# EAGLE design NTcounterRX (EAGLE 9.0.1)
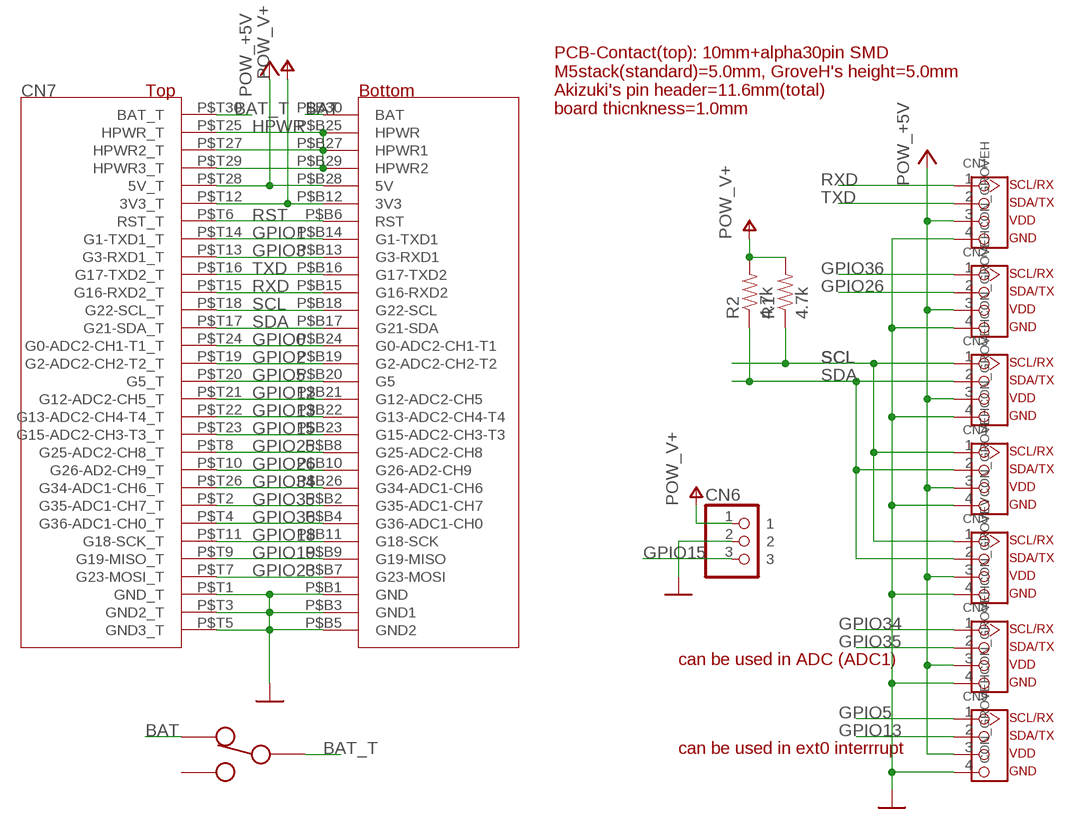
[diagram p0: schematic, sheet 1]

## Parts
CN1  CON_GROVEH  [CON_GROVE_H]
CN2  CON_GROVEH  [CON_GROVE_H]
CN3  CON_GROVEH  [CON_GROVE_H]
CN4  CON_GROVEH  [CON_GROVE_H]
CN5  CON_GROVEV  [CON_GROVE_V]
CN6  CON_PINHD-1X3R  [1X03R]
CN7  MBUS_SEPBAT  [MBUS_SEP_BAT_SHORT]
CN8  CON_GROVEH  [CON_GROVE_H]
CN9  CON_GROVEH  [CON_GROVE_H]
R1  4.7k  RES0603  [0603]
R2  4.7k  RES0603  [0603]
SW1  SW_SLIDESK12D01  [SW_SK12D01]

## Nets
+5V: CN1.3 CN2.3 CN3.3 CN4.3 CN5.3 CN7.P$B28(5V) CN7.P$T28(5V_T) CN8.3 CN9.3 ; supply symbol labelled POW_+5V
BAT: CN7.P$B30(BAT) SW1.P$1
BAT_T: CN7.P$T30(BAT_T) SW1.P$2
GND: CN1.4 CN2.4 CN3.4 CN4.4 CN5.4 CN6.2 CN7.P$B1(GND) CN7.P$B3(GND1) CN7.P$B5(GND2) CN7.P$T1(GND_T) CN7.P$T3(GND2_T) CN7.P$T5(GND3_T) CN8.4 CN9.4 ; supply symbol labelled POW_GND
GPIO0: CN7.P$B24(G0-ADC2-CH1-T1) CN7.P$T24(G0-ADC2-CH1-T1_T)
GPIO1: CN7.P$B14(G1-TXD1) CN7.P$T14(G1-TXD1_T)
GPIO2: CN7.P$B19(G2-ADC2-CH2-T2) CN7.P$T19(G2-ADC2-CH2-T2_T)
GPIO3: CN7.P$B13(G3-RXD1) CN7.P$T13(G3-RXD1_T)
GPIO5: CN7.P$B20(G5) CN7.P$T20(G5_T) CN9.1
GPIO12: CN7.P$B21(G12-ADC2-CH5) CN7.P$T21(G12-ADC2-CH5_T)
GPIO13: CN7.P$B22(G13-ADC2-CH4-T4) CN7.P$T22(G13-ADC2-CH4-T4_T) CN9.2
GPIO15: CN6.3 CN7.P$B23(G15-ADC2-CH3-T3) CN7.P$T23(G15-ADC2-CH3-T3_T)
GPIO18: CN7.P$B11(G18-SCK) CN7.P$T11(G18-SCK_T)
GPIO19: CN7.P$B9(G19-MISO) CN7.P$T9(G19-MISO_T)
GPIO23: CN7.P$B7(G23-MOSI) CN7.P$T7(G23-MOSI_T)
GPIO25: CN7.P$B8(G25-ADC2-CH8) CN7.P$T8(G25-ADC2-CH8_T)
GPIO26: CN2.2 CN7.P$B10(G26-AD2-CH9) CN7.P$T10(G26-AD2-CH9_T)
GPIO34: CN7.P$B26(G34-ADC1-CH6) CN7.P$T26(G34-ADC1-CH6_T) CN8.1
GPIO35: CN7.P$B2(G35-ADC1-CH7) CN7.P$T2(G35-ADC1-CH7_T) CN8.2
GPIO36: CN2.1 CN7.P$B4(G36-ADC1-CH0) CN7.P$T4(G36-ADC1-CH0_T)
HPWR: CN7.P$B25(HPWR) CN7.P$B27(HPWR1) CN7.P$B29(HPWR2) CN7.P$T25(HPWR_T) CN7.P$T27(HPWR2_T) CN7.P$T29(HPWR3_T)
RST: CN7.P$B6(RST) CN7.P$T6(RST_T)
RXD: CN1.1 CN7.P$B15(G16-RXD2) CN7.P$T15(G16-RXD2_T)
SCL: CN3.1 CN4.1 CN5.1 CN7.P$B18(G22-SCL) CN7.P$T18(G22-SCL_T) R1.1
SDA: CN3.2 CN4.2 CN5.2 CN7.P$B17(G21-SDA) CN7.P$T17(G21-SDA_T) R2.1
TXD: CN1.2 CN7.P$B16(G17-TXD2) CN7.P$T16(G17-TXD2_T)
V+: CN6.1 CN7.P$B12(3V3) CN7.P$T12(3V3_T) R1.2 R2.2 ; supply symbol labelled POW_V+

## Notes on the sheet
- PCB-Contact(top): 10mm+alpha30pin SMD
  M5stack(standard)=5.0mm, GroveH's height=5.0mm
  Akizuki's pin header=11.6mm(total)
  board thicnkness=1.0mm
- can be used in ADC (ADC1)
- can be used in ext0 interrrupt

## Power pins joined to a net without a drawn wire
P$3: SW1.P$3

## Library data of the parts
CN1-CN5 CN8 CN9 = akita:CON_GROVE: Seeed Grove
CN6 = akita:CON_PINHD-1X3: PIN HEADER
CN7 = m5amigo:MBUS_SEP: M5stack's Mbus, Top/Bottom separated
R1 R2 = akita:RES: Resistor Basic schematic elements and footprints for 0603, 1206, and PTH resistors.
SW1 = akita:SW_SLIDE

## Board
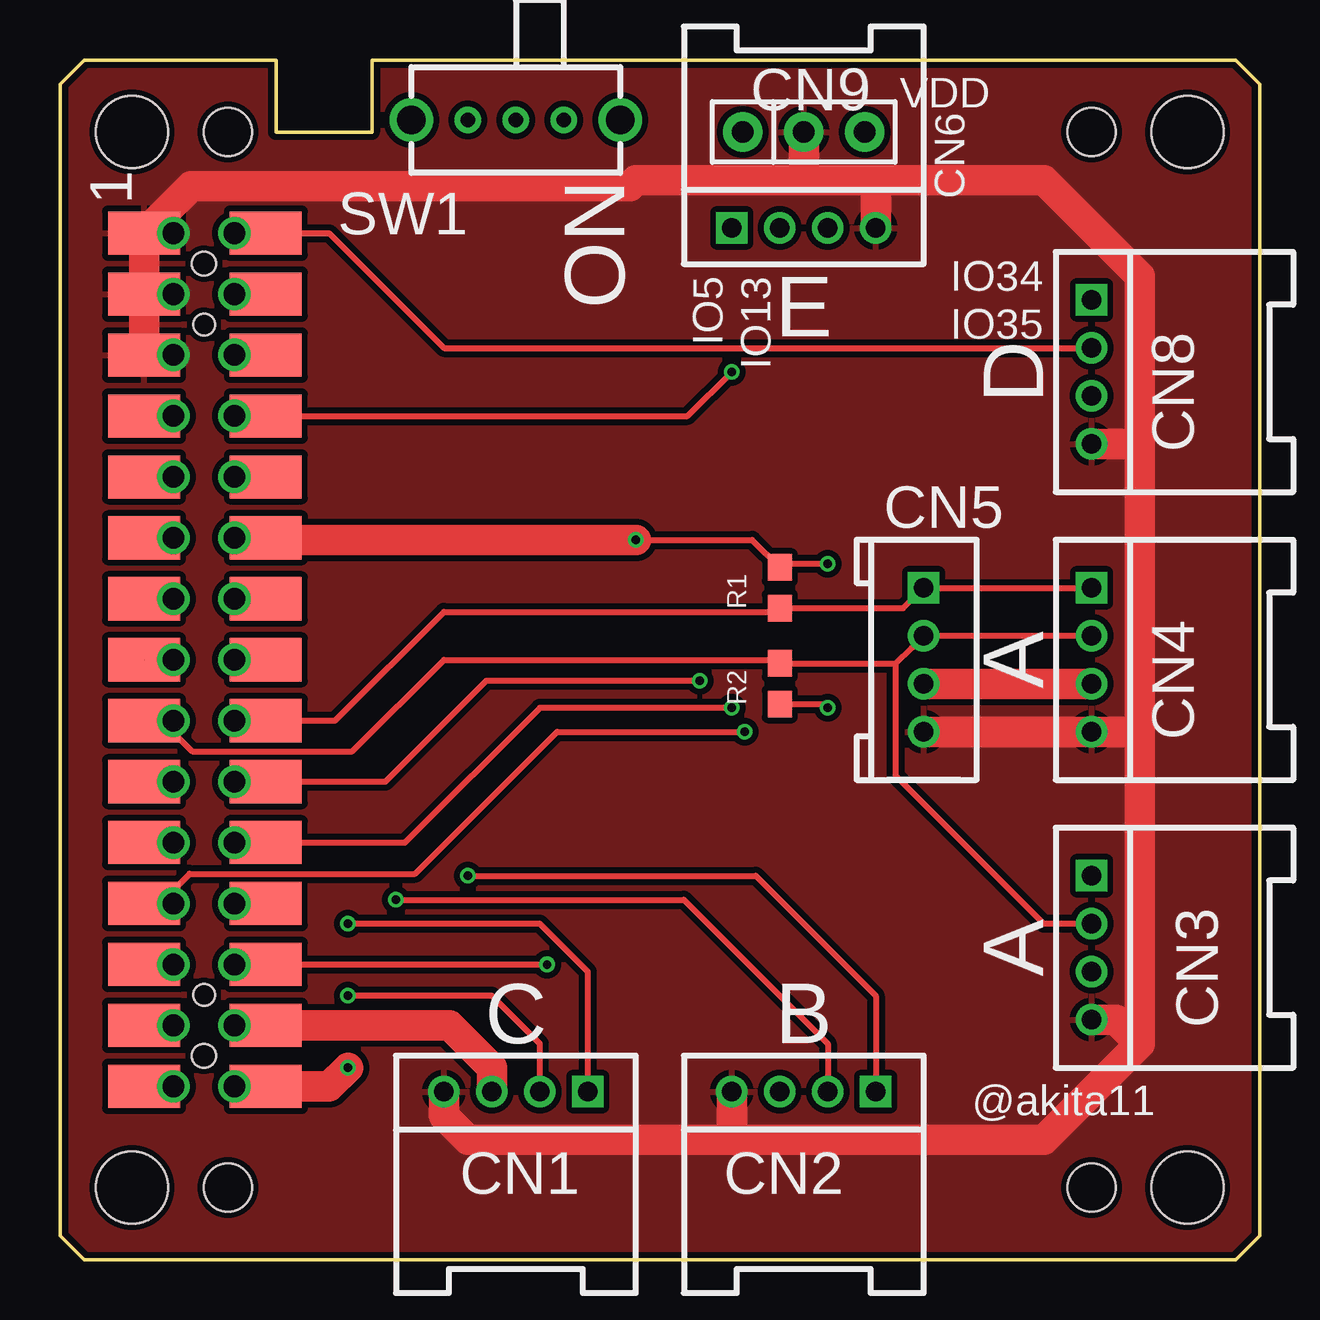
[diagram p1: board, top side]
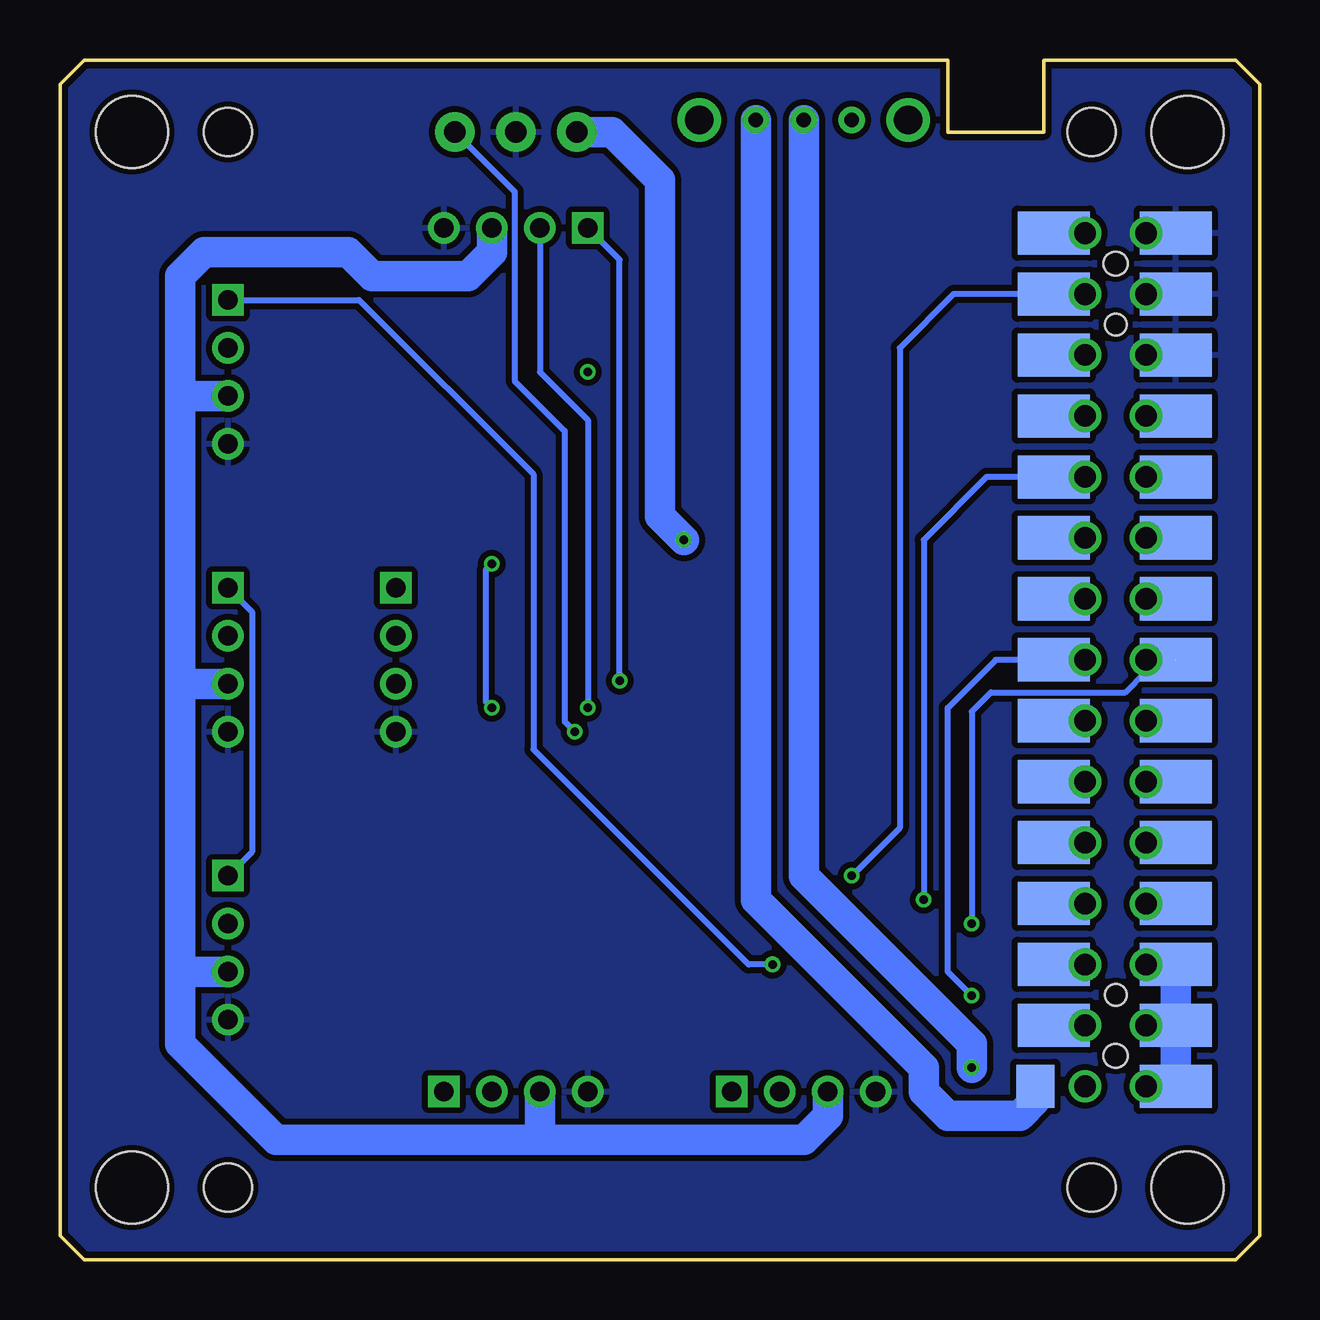
[diagram p2: board, bottom side, seen from below]

Size 50 x 50 mm. Coordinates in mm from the lower left corner, seen from the top.
Copper layers (1*16): Top 0.035mm / dielectric 1.5mm / Bottom 0.035mm
Design rules "SeeedStudio_2layer_DRU_no_angle_20140221": minimum track width 6mil, minimum drill 12mil, track to track 6mil, track to pad 6mil, pad to pad 6mil, via to via 6mil, smd to smd 0mil, copper to edge 10mil, drill to drill 10mil, minimum pad ring 10mil, minimum via ring 6mil, stop-mask expansion 2mil, vias tented up to drill 100mil, thermal gap 10mil

### Footprints (pad centres in the part's own frame; a part is rotated, then mirrored left to right if it is on the bottom)
CON_GROVE_H = drill 0.8 pad 1.27 square: 1 -3,0 | drill 0.8 pad 1.27: 2 -1,0; 3 1,0; 4 3,0
CON_GROVE_V = drill 0.8 pad 1.27 square: 1 -3,0 | drill 0.8 pad 1.27: 2 -1,0; 3 1,0; 4 3,0
1X03R = drill 0.9 pad 1.651: 1 -2.54,0; 2 0,0; 3 2.54,0
MBUS_SEP_BAT_SHORT = smd 3 x 1.8 bottom: P$B1 3.5,42.78; P$B2 8.58,42.78; P$B3 3.5,40.24; P$B4 8.58,40.24; P$B5 3.5,37.7; P$B6 8.58,37.7; P$B7 3.5,35.16; P$B8 8.58,35.16; P$B9 3.5,32.62; P$B10 8.58,32.62; P$B11 3.5,30.08; P$B12 8.58,30.08; P$B13 3.5,27.54; P$B14 8.58,27.54; P$B15 3.5,25; P$B16 8.58,25; P$B17 3.5,22.46; P$B18 8.58,22.46; P$B19 3.5,19.92; P$B20 8.58,19.92; P$B21 3.5,17.38; P$B22 8.58,17.38; P$B23 3.5,14.84; P$B24 8.58,14.84; P$B25 3.5,12.3; P$B26 8.58,12.3; P$B27 3.5,9.76; P$B28 8.58,9.76; P$B29 3.5,7.22 | smd 1.6 x 1.8 bottom: P$B30 9.342,7.22 | smd 3 x 1.8: P$T1 3.5,42.78; P$T2 8.58,42.78; P$T3 3.5,40.24; P$T4 8.58,40.24; P$T5 3.5,37.7; P$T6 8.58,37.7; P$T7 3.5,35.16; P$T8 8.58,35.16; P$T9 3.5,32.62; P$T10 8.58,32.62; P$T11 3.5,30.08; P$T12 8.58,30.08; P$T13 3.5,27.54; P$T14 8.58,27.54; P$T15 3.5,25; P$T16 8.58,25; P$T17 3.5,22.46; P$T18 8.58,22.46; P$T19 3.5,19.92; P$T20 8.58,19.92; P$T21 3.5,17.38; P$T22 8.58,17.38; P$T23 3.5,14.84; P$T24 8.58,14.84; P$T25 3.5,12.3; P$T26 8.58,12.3; P$T27 3.5,9.76; P$T28 8.58,9.76; P$T29 3.5,7.22; P$T30 8.58,7.22 | hole 3: 3,3; 3,47; 47,47; 47,3 | hole 2: 7,3; 7,47; 43,47; 43,3 | hole 0.9: 6,38.97; 6,11.03 | hole 1: 6,41.51; 6,8.49
0603 = smd 1.1 x 1: 1 -0.85,0; 2 0.85,0
SW_SK12D01 = drill 0.6: P$1 -2,0; P$2 0,0; P$3 2,0 | drill 1.2: P$4 -4.35,0; P$5 4.35,0

### Placement (x,y rotation side)
CN1  19,7 180 top
CN2  31,7 180 top
CN3  43,13 270 top
CN4  43,25 270 top
CN5  36,25 270 top
CN6  31,47 0 top
CN7  0,0 0 top
CN8  43,37 270 top
CN9  31,43 0 top
R1  30,28 90 top
R2  30,24 270 top
SW1  19,47.5 180 top

### Tracks (layer width: path | path; a pad name or v marks a point on that pad's centre or on a via)
+5V  (via drill 0.9)
  Top 0.254: CN7.P$B28 v7.27,9.76
  Top 1.27: CN5.3 CN4.3 | CN7.P$B28 16.24,9.76 18,8 CN1.3
  Bottom 0.254: CN7.P$B28 v7.27,9.76
  Bottom 1.27: CN1.3 18,6 19,5 30,5 | 30,5 41,5 45,9 45,12 | 45,12 45,24 | 45,24 45,36 | 45,36 45,41 44,42 38,42 37,41 33,41 32,42 CN9.3 | CN8.3 45,36 | CN4.3 45,24 | CN3.3 45,12 | CN2.3 30,5
BAT
  Bottom 1.27: SW1.P$1 21,15 14,8 14,7 13,6 10,6 9.34,6.66 CN7.P$B30
BAT_T  (via drill 0.35, 0.9)
  Top 0.254: CN7.P$T30 8,7.22 v7.27,7.22
  Top 1.27: v12,8 11.22,7.22 8,7.22
  Bottom 1.27: SW1.P$2 19,16 12,9 v12,8
GND  (via drill 0.9)
  Top 0.254: CN7.P$B3 v4.73,40.24
  Top 0.61: CN7.P$B1 v4.73,42.78 | CN7.P$B5 v4.73,37.7
  Top 1.27: CN7.P$B5 CN7.P$B3 CN7.P$B1 5.47,44.75 23.75,44.75 24,45 31,45 | 45,34 45,41 41,45 34,45 | 45,34 45,22 | 45,22 45,9 | 45,9 41,5 28,5 | 28,5 17,5 16,6 CN1.4 | CN8.4 45,34 | 45,22 CN4.4 CN5.4 | CN3.4 44,10 45,9 | CN2.4 28,5 | 31,45 34,45 | CN9.4 34,45 | CN6.2 31,45
  Bottom 0.254: CN7.P$B3 v4.73,40.24 | CN7.P$B5 v4.73,37.7
  Bottom 0.61: CN7.P$B1 v4.73,42.78
  pour Top (isolate 0.25): 0,50 50,50 50,0 0,0
  pour Bottom (isolate 0.25): 0,50 50,50 50,0 0,0
GPIO0  (via drill 0.9)
  Top 0.254: CN7.P$B24 v7.27,14.84
  Bottom 0.254: CN7.P$B24 v7.27,14.84
GPIO1  (via drill 0.9)
  Top 0.61: CN7.P$T14 v7.27,27.54
  Bottom 0.254: CN7.P$T14 v7.27,27.54
GPIO2  (via drill 0.9)
  Top 0.254: CN7.P$B19 v4.73,19.92
  Bottom 0.254: CN7.P$B19 v4.73,19.92
GPIO3  (via drill 0.9)
  Top 0.254: CN7.P$T13 v4.73,27.54
  Bottom 0.254: CN7.P$T13 v4.73,27.54
GPIO5  (via drill 0.35, 0.9)
  Top 0.254: v7.27,19.92 CN7.P$T20 13.57,19.92 17.78,24.13 v26.67,24.13
  Bottom 0.254: CN7.P$T20 v7.27,19.92 | CN9.1 26.67,41.67 v26.67,24.13
GPIO12  (via drill 0.9)
  Top 0.254: CN7.P$B21 v4.73,17.38
  Bottom 0.254: CN7.P$B21 v4.73,17.38
GPIO13  (via drill 0.35, 0.9)
  Top 0.254: v7.27,17.38 CN7.P$T22 14.38,17.38 20,23 v28,23
  Bottom 0.254: CN7.P$T22 v7.27,17.38 | CN9.2 30,37 28,35 v28,23
GPIO15  (via drill 0.35, 0.9)
  Top 0.254: v4.73,14.84 CN7.P$B23 4.16,14.84 5.4,16.08 14.81,16.08 20.73,22 v28.54,22
  Bottom 0.254: CN7.P$B23 v4.73,14.84 | CN6.3 31.05,44.51 31.05,36.62 28.96,34.54 28.96,22.42 v28.54,22
GPIO18  (via drill 0.9)
  Top 0.254: CN7.P$B11 v4.73,30.08
  Bottom 0.254: CN7.P$B11 v4.73,30.08
GPIO19  (via drill 0.9)
  Top 0.254: CN7.P$T9 v4.73,32.62
  Bottom 0.254: CN7.P$T9 v4.73,32.62
GPIO23  (via drill 0.9)
  Top 0.254: CN7.P$B7 v4.73,35.16
  Bottom 0.254: CN7.P$B7 v4.73,35.16
GPIO25  (via drill 0.35, 0.9)
  Top 0.254: CN7.P$T8 26.16,35.16 v28,37
  Top 0.61: CN7.P$T8 v7.27,35.16
  Bottom 0.254: CN7.P$T8 v7.27,35.16
GPIO26  (via drill 0.35, 0.9)
  Top 0.254: v14,15 26,15 32,9 CN2.2
  Top 0.61: CN7.P$B10 v7.27,32.62
  Bottom 0.254: v7.27,32.62 CN7.P$B10 11.38,32.62 14,30 v14,15
GPIO34  (via drill 0.35, 0.9)
  Top 0.254: v7.27,12.3 CN7.P$T26 v20.3,12.3
  Bottom 0.254: CN7.P$T26 v7.27,12.3 | CN8.1 37.54,40 30.27,32.73 30.27,21.27 21.3,12.3 v20.3,12.3
GPIO35  (via drill 0.9)
  Top 0.254: CN8.2 16,38 11.22,42.78 CN7.P$B2
  Top 0.61: CN7.P$B2 v7.27,42.78
  Bottom 0.61: CN7.P$B2 v7.27,42.78
GPIO36  (via drill 0.35, 0.9)
  Top 0.254: CN2.1 34,11 29,16 v17,16
  Top 0.61: CN7.P$T4 v7.27,40.24
  Bottom 0.254: v7.27,40.24 CN7.P$T4 12.76,40.24 15,38 15,18 v17,16
HPWR  (via drill 0.9)
  Top 0.254: CN7.P$T25 4.7,12.3 5,12 5,12.03 v4.73,12.3 | CN7.P$T27 v4.73,9.76 | CN7.P$B29 v4.73,7.22
  Bottom 0.254: CN7.P$B29 v4.73,7.22 | CN7.P$T27 v4.73,9.76 | CN7.P$T25 v4.73,12.3
  Bottom 1.27: CN7.P$T25 CN7.P$T27 CN7.P$B29
RST  (via drill 0.9)
  Top 0.61: CN7.P$T6 v7.27,37.7
  Bottom 0.254: CN7.P$T6 v7.27,37.7
RXD  (via drill 0.35, 0.9)  (1 unrouted)
  Top 0.254: v12,14 20,14 22,12 CN1.1 | CN7.P$B15 v4.73,25
  Bottom 0.254: v12,14 12,22.84 11.2,23.64 5.59,23.64 4.73,24.5 v4.73,25
SCL  (via drill 0.9)
  Top 0.254: v7.27,22.46 CN7.P$B18 11.46,22.46 16,27 29.85,27 R1.1 35.15,27.15 CN5.1 CN4.1
  Bottom 0.254: CN7.P$B18 v7.27,22.46 | CN4.1 42,27 42,17 CN3.1
SDA  (via drill 0.9)
  Top 0.254: CN7.P$B17 4,22.46 | 4,22.46 v4.73,22.46 | CN7.P$B17 4,22.46 | CN7.P$B17 4.24,22.46 5.52,21.18 12.18,21.18 16,25 29.85,25 R2.1 34.85,24.85 | 34.85,24.85 35.5,25.5 | 35.5,25.5 CN5.2 | CN4.2 CN5.2 | CN5.2 35.5,25.5 | CN3.2 41,14 34.85,20.15 34.85,24.85
  Bottom 0.254: CN7.P$B17 v4.73,22.46
TXD  (via drill 0.35, 0.9)
  Top 0.254: CN7.P$T16 v7.27,25 | CN1.2 20,9 18,11 v12,11
  Bottom 0.254: v7.27,25 CN7.P$T16 11,25 13,23 13,12 v12,11
V+  (via drill 0.35, 0.9)
  Top 0.254: v24,30 28.85,30 R1.2 30.15,29 v32,29 | R2.2 31.85,23.15 v32,23
  Top 0.61: CN7.P$B12 v7.27,30.08
  Top 1.27: v24,30 8.66,30 CN7.P$B12
  Bottom 0.254: CN7.P$B12 v7.27,30.08 | v32,23 32.25,23.25 32.25,28.75 v32,29
  Bottom 1.27: v24,30 25,31 25,45 27,47 CN6.1

### Text on the board
tPlace: VDD | ON | IO5 | IO13 | E | IO34 | IO35 | D | A | A | C | B | @akita11